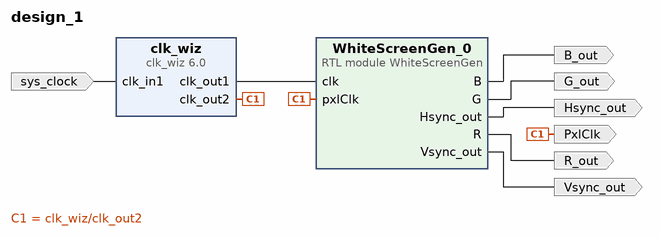
[diagram p0: block diagram of the top level]
# Vivado block design design_1, xc7z020clg400-1, Vivado 2023.1
create_bd_design design_1

create_bd_port -dir I -type clk sys_clock
set_property -dict {CONFIG.FREQ_HZ 125000000 CONFIG.PHASE 0.0} [get_bd_ports sys_clock]
create_bd_port -dir O R_out
create_bd_port -dir O G_out
create_bd_port -dir O B_out
create_bd_port -dir O Vsync_out
create_bd_port -dir O Hsync_out
create_bd_port -dir O PxlClk

create_bd_cell -type ip -vlnv xilinx.com:ip:clk_wiz:6.0 clk_wiz
set_property -dict [list \
  CONFIG.CLKFB_IN_SIGNALING SINGLE \
  CONFIG.CLKIN2_JITTER_PS 133.33 \
  CONFIG.CLKOUT1_JITTER 112.754 \
  CONFIG.CLKOUT1_PHASE_ERROR 86.070 \
  CONFIG.CLKOUT2_DRIVES BUFG \
  CONFIG.CLKOUT2_JITTER 148.894 \
  CONFIG.CLKOUT2_PHASE_ERROR 86.070 \
  CONFIG.CLKOUT2_REQUESTED_OUT_FREQ 25.26596 \
  CONFIG.CLKOUT2_USED true \
  CONFIG.CLK_IN1_BOARD_INTERFACE sys_clock \
  CONFIG.FEEDBACK_SOURCE FDBK_AUTO \
  CONFIG.MMCM_CLKFBOUT_MULT_F 9.500 \
  CONFIG.MMCM_CLKIN2_PERIOD 10.000 \
  CONFIG.MMCM_CLKOUT0_DIVIDE_F 11.875 \
  CONFIG.MMCM_CLKOUT1_DIVIDE 47 \
  CONFIG.MMCM_COMPENSATION ZHOLD \
  CONFIG.NUM_OUT_CLKS 2 \
  CONFIG.SECONDARY_IN_FREQ 100.000 \
  CONFIG.SECONDARY_SOURCE Single_ended_clock_capable_pin \
  CONFIG.USE_BOARD_FLOW true \
  CONFIG.USE_INCLK_SWITCHOVER false \
] [get_bd_cells clk_wiz]
create_bd_cell -type module -reference WhiteScreenGen WhiteScreenGen_0

# ---- connections ----

connect_bd_net [get_bd_pins WhiteScreenGen_0/B] [get_bd_ports B_out]
connect_bd_net [get_bd_pins WhiteScreenGen_0/G] [get_bd_ports G_out]
connect_bd_net [get_bd_pins WhiteScreenGen_0/Hsync_out] [get_bd_ports Hsync_out]
connect_bd_net [get_bd_pins WhiteScreenGen_0/R] [get_bd_ports R_out]
connect_bd_net [get_bd_pins WhiteScreenGen_0/Vsync_out] [get_bd_ports Vsync_out]
connect_bd_net [get_bd_pins clk_wiz/clk_out1] [get_bd_pins WhiteScreenGen_0/clk]
connect_bd_net [get_bd_pins clk_wiz/clk_out2] [get_bd_ports PxlClk] [get_bd_pins WhiteScreenGen_0/pxlClk]
connect_bd_net [get_bd_ports sys_clock] [get_bd_pins clk_wiz/clk_in1]

validate_bd_design
save_bd_design
